# EAGLE design retro_hat_v1 (EAGLE 7.5.0)
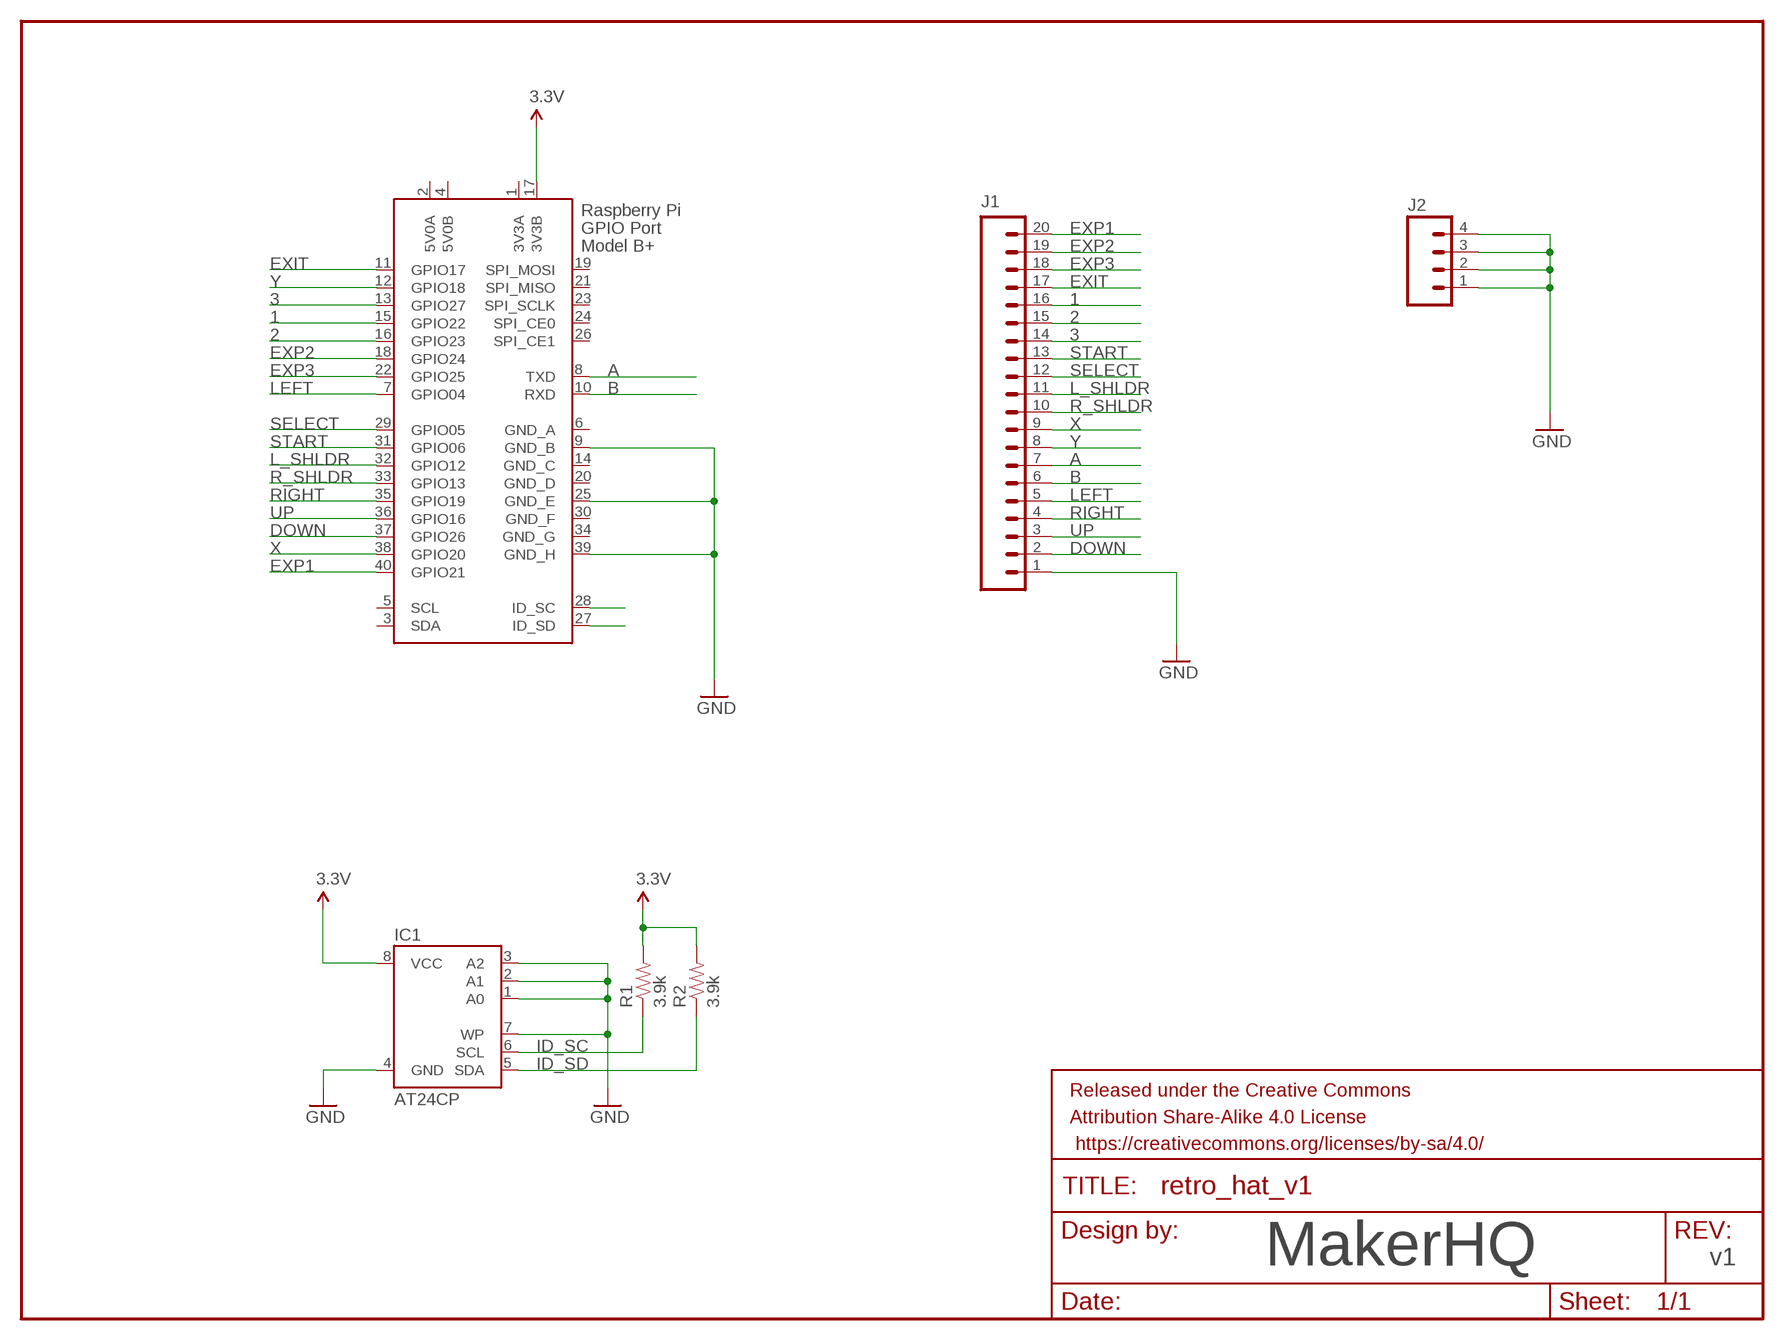
[diagram p0: schematic, sheet 1]

## Parts
FRAME1  FRAME-LETTERNO_PACKAGE  [DUMMY]
IC1  AT24CP  [DIL08]
J1  M20  [1X20]
J2  M04PTH  [1X04]
R1  3.9k  RESISTORPTH-1/4W  [AXIAL-0.4]
R2  3.9k  RESISTORPTH-1/4W  [AXIAL-0.4]
X1  RASPI_BOARD_B+#_HD  [RASPI_BOARD_B+HAT_DF]

## Nets
1: J1.16 X1.15(GPIO22)
2: J1.15 X1.16(GPIO23)
3: J1.14 X1.13(GPIO27)
3.3V: IC1.8(VCC) R1.P$2 R2.P$2 X1.17(3V3B)
A: J1.7 X1.8(TXD)
B: J1.6 X1.10(RXD)
DOWN: J1.2 X1.37(GPIO26)
EXIT: J1.17 X1.11(GPIO17)
EXP1: J1.20 X1.40(GPIO21)
EXP2: J1.19 X1.18(GPIO24)
EXP3: J1.18 X1.22(GPIO25)
GND: IC1.1(A0) IC1.2(A1) IC1.3(A2) IC1.4(GND) IC1.7(WP) J1.1 J2.1 J2.2 J2.3 J2.4 X1.9(GND_B) X1.25(GND_E) X1.39(GND_H)
ID_SC: IC1.6(SCL) R1.P$1 X1.28(ID_SC)
ID_SD: IC1.5(SDA) R2.P$1 X1.27(ID_SD)
L_SHLDR: J1.11 X1.32(GPIO12)
LEFT: J1.5 X1.7(GPIO04)
R_SHLDR: J1.10 X1.33(GPIO13)
RIGHT: J1.4 X1.35(GPIO19)
SELECT: J1.12 X1.29(GPIO05)
START: J1.13 X1.31(GPIO06)
UP: J1.3 X1.36(GPIO16)
X: J1.9 X1.38(GPIO20)
Y: J1.8 X1.12(GPIO18)
Unconnected: X1.3(SDA) X1.5(SCL) X1.19(SPI_MOSI) X1.21(SPI_MISO) X1.23(SPI_SCLK) X1.24(SPI_CE0) X1.26(SPI_CE1)

## Notes on the sheet
- MakerHQ | v1

## Power pins joined to a net without a drawn wire
3V3A: X1.1(3V3A)
5V0A: X1.2(5V0A)
5V0B: X1.4(5V0B)
GND_A: X1.6(GND_A)
GND_C: X1.14(GND_C)
GND_D: X1.20(GND_D)
GND_F: X1.30(GND_F)
GND_G: X1.34(GND_G)

## Library data of the parts
FRAME1 = SparkFun-Aesthetics:FRAME-LETTER: Schematic Frame Standard 8.5x11 US Letter frame; DESIGNER: Nobody; VERSION: v01
IC1 = atmel:AT24C*: 2-wire serial EEPROM; MPN: AT24C1024BW-SH-B; OC_FARNELL: 1362646; OC_NEWARK: 03P2044
J1 = SparkFun-Connectors:M20: 1x20 .1" header This is just like the LOCK variant in that the holes are staggared by 5 mil, but except for the last two holes. They are not altered from the "standard" footprint layout. This is used for a special purpose on the layout of our Graphic LCD Backpack. Make sure you want to use this device before selecting it for you project!
J2 = SparkFun-Connectors:M04: Header 4 Standard 4-pin 0.1" header. Use with straight break away headers (SKU : PRT-00116), right angle break away headers (PRT-00553), swiss pins (PRT-00743), machine pins (PRT-00117), and female headers (PRT-00115). Molex polarized connector foot print use with SKU : PRT-08231 with associated crimp pins and housings. 1MM SMD Version SKU: PRT-10208; PROD_ID: CONN-09696
R1 R2 = SparkFun-Passives:RESISTOR: Resistor Basic schematic elements and footprints for 0603, 1206, and PTH resistors.
X1 = raspberrypi_bastelstube_v13:RASPI_BOARD_B+#: Raspberry Pi GPIO connector with markings for the outer dimensions of the Raspberry Pi board model B+ with different sets of drill holes or mounting pads All pins connected

## Board
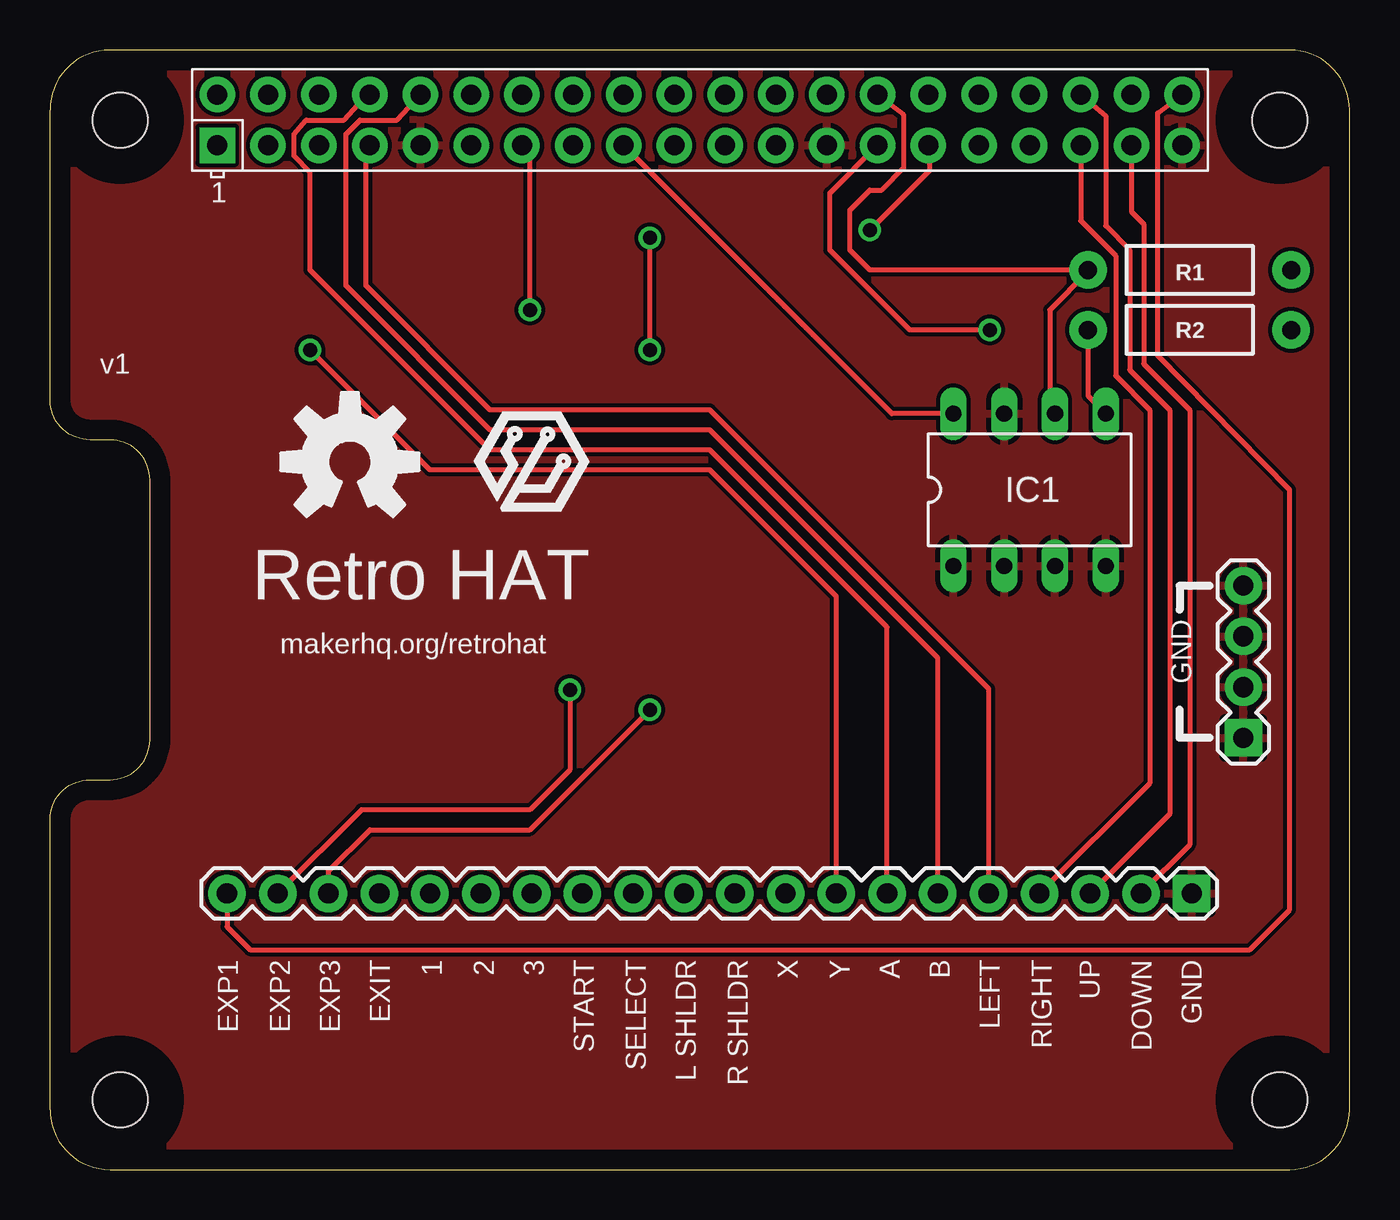
[diagram p1: board, top side]
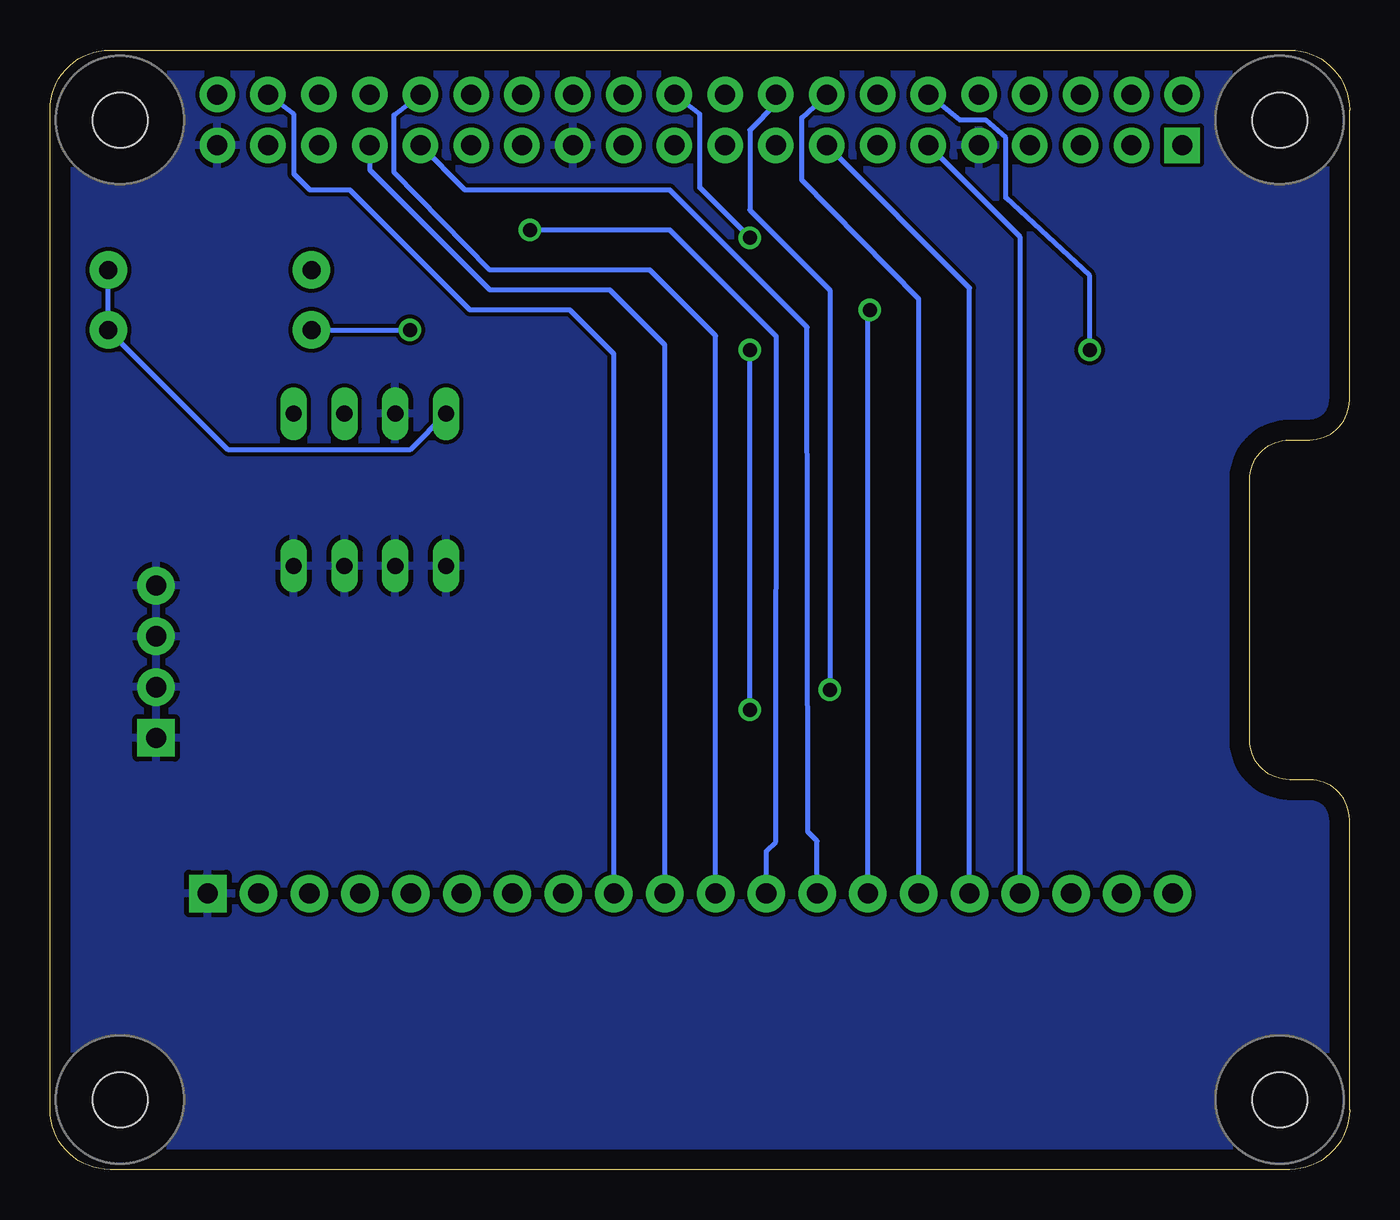
[diagram p2: board, bottom side, seen from below]

Size 65 x 56 mm. Coordinates in mm from the lower left corner, seen from the top.
Copper layers (1*16): Top 0.035mm / dielectric 1.5mm / Bottom 0.035mm
Design rules "default": minimum track width 10mil, minimum drill 24mil, track to track 8mil, track to pad 8mil, pad to pad 8mil, via to via 8mil, smd to smd 8mil, copper to edge 40mil, drill to drill 8mil, minimum pad ring 10mil, minimum via ring 8mil, stop-mask expansion 4mil, vias tented up to drill 0mil, thermal gap 10mil
tRestrict: area 1.2,50.2 to 5.8,54.8; area 1.2,1.2 to 5.8,5.8; area 59.2,1.2 to 63.8,5.8; area 59.2,50.2 to 63.8,54.8
bRestrict: area 1.2,50.2 to 5.8,54.8; area 59.2,50.2 to 63.8,54.8; area 1.2,1.2 to 5.8,5.8; area 59.2,1.2 to 63.8,5.8

### Footprints (pad centres in the part's own frame; a part is rotated, then mirrored left to right if it is on the bottom)
DIL08 = drill 0.813 long: 1 -3.81,-3.81; 2 -1.27,-3.81; 3 1.27,-3.81; 4 3.81,-3.81; 5 3.81,3.81; 6 1.27,3.81; 7 -1.27,3.81; 8 -3.81,3.81
1X20 = drill 1.016 pad 1.88 square: 1 0,0 | drill 1.016 pad 1.88: 2 2.54,0; 3 5.08,0; 4 7.62,0; 5 10.16,0; 6 12.7,0; 7 15.24,0; 8 17.78,0; 9 20.32,0; 10 22.86,0; 11 25.4,0; 12 27.94,0; 13 30.48,0; 14 33.02,0; 15 35.56,0; 16 38.1,0; 17 40.64,0; 18 43.18,0; 19 45.72,0; 20 48.26,0
1X04 = drill 1.016 pad 1.88 square: 1 0,0 | drill 1.016 pad 1.88: 2 2.54,0; 3 5.08,0; 4 7.62,0
AXIAL-0.4 = drill 0.9 pad 1.88: P$1 -5.08,0; P$2 5.08,0
RASPI_BOARD_B+HAT_DF = drill 1 pad 1.778 square: 1 8.37,51.23 | drill 1 pad 1.778: 2 8.37,53.77; 3 10.91,51.23; 4 10.91,53.77; 5 13.45,51.23; 6 13.45,53.77; 7 15.99,51.23; 8 15.99,53.77; 9 18.53,51.23; 10 18.53,53.77; 11 21.07,51.23; 12 21.07,53.77; 13 23.61,51.23; 14 23.61,53.77; 15 26.15,51.23; 16 26.15,53.77; 17 28.69,51.23; 18 28.69,53.77; 19 31.23,51.23; 20 31.23,53.77; 21 33.77,51.23; 22 33.77,53.77; 23 36.31,51.23; 24 36.31,53.77; 25 38.85,51.23; 26 38.85,53.77; 27 41.39,51.23; 28 41.39,53.77; 29 43.93,51.23; 30 43.93,53.77; 31 46.47,51.23; 32 46.47,53.77; 33 49.01,51.23; 34 49.01,53.77; 35 51.55,51.23; 36 51.55,53.77; 37 54.09,51.23; 38 54.09,53.77; 39 56.63,51.23; 40 56.63,53.77 | hole 2.75: 3.5,3.5; 3.5,52.5; 61.5,3.5; 61.5,52.5

### Placement (x,y rotation side)
FRAME1  -52.07,67.31 0 top  (outside the outline)
IC1  49,34 0 top
J1  57.11,13.81 180 top
J2  59.69,21.59 90 top
R1  57,45 0 top
R2  57,42 0 top
U$1  [MAKERHQ_LOGO_L]  21.2,32.9 0 top
U$2  [OSHW-LOGO-L]  15,35.4 0 top
X1  0,0 0 top

### Tracks (layer width: path | path; a pad name or v marks a point on that pad's centre or on a via)
1
  Bottom 0.254: J1.16 19.01,44.09 X1.15
2
  Bottom 0.254: J1.15 21.55,43.55 27.4,49.5 27.4,52.62 X1.16
3  (via drill 0.7)
  Top 0.254: v24,43 24,50.84 X1.13
  Bottom 0.254: J1.14 24.09,42.91 v24,43
3.3V
  Top 0.254: IC1.8 42.11,37.81 X1.17
  Bottom 0.254: IC1.8 47,36 56.08,36 R2.P$2 R1.P$2
A
  Top 0.254: J1.7 41.87,27.13 33,36 22,36 13,45 13,49.9 12.2,50.7 12.2,51.8 12.82,52.5 14.7,52.5 15.87,53.77 X1.8
B
  Top 0.254: J1.6 44.41,25.59 33,37 22,37 14.8,44.2 14.8,51.8 15.5,52.5 17.36,52.5 X1.10
DOWN
  Top 0.254: X1.37 54.09,47.91 54.7,47.3 54.7,40.3 57,38 57,16.24 J1.2
EXIT
  Bottom 0.254: J1.17 16.47,46.63 X1.11
EXP1
  Top 0.254: J1.20 8.85,12.15 10,11 60,11 62,13 62,34 55.4,40.7 55.4,52.84 X1.40
EXP2  (via drill 0.7)
  Top 0.254: v26,24 26,20 24,18 15.58,18 J1.19
  Bottom 0.254: X1.18 28.69,53.31 30,52 30,48 26,44 v26,24
EXP3  (via drill 0.7)
  Top 0.254: J1.18 13.93,14.93 16,17 24,17 v30,23 | v30,41 v30,46.6
  Bottom 0.254: v30,23 v30,41 | v30,46.6 32.5,49.1 32.5,52.8 X1.22
GND
  pour Top: 0,0 65,0 65,56 0,56
  pour Bottom: 0,0 65,0 65,56 0,56
ID_SC
  Top 0.254: IC1.6 50,38.08 50,43 51.92,44.92 R1.P$1 41,45 40,46 40,48 41,49 41.6,49 42.7,50.1 42.7,52.76 X1.28
ID_SD  (via drill 0.7)
  Top 0.254: R2.P$1 51.92,38.7 IC1.5 | v47,42 43,42 39,46 39,48.84 X1.27
  Bottom 0.254: R2.P$1 v47,42
L_SHLDR
  Bottom 0.254: J1.11 31.71,41.71 35,45 43,45 47.8,49.9 47.8,52.74 X1.32
LEFT
  Top 0.254: J1.5 46.95,24.05 33,38 22,38 15.8,44.2 15.8,50.94 X1.7
R_SHLDR
  Bottom 0.254: J1.10 34.25,41.25 37,44 43,44 49,50 X1.33
RIGHT
  Top 0.254: X1.35 51.55,47.45 53.3,45.7 53.3,39.7 55,38 55,19.32 J1.4
SELECT  (via drill 0.7)
  Top 0.254: v41,47 44,50 44,51.16 X1.29
  Bottom 0.254: J1.12 29.17,15.93 28.7,16.4 28.67,41.67 34,47 v41,47
START
  Bottom 0.254: J1.13 26.63,16.43 27.1,16.9 27.13,42.13 34,49 44.24,49 X1.31
UP
  Top 0.254: X1.36 52.03,53.37 52.8,52.7 52.8,47.2 54,46 54,40 56,38 56,17.78 J1.3
X
  Bottom 0.254: J1.9 36.79,40.79 39,43 44,43 50,49 52,49 52.8,49.8 52.8,52.78 X1.38
Y  (via drill 0.7)
  Top 0.254: J1.8 39.33,28.67 33,35 19,35 v13,41
  Bottom 0.254: v13,41 13,44.7 17.2,48.6 17.2,51.6 18.2,52.5 19.5,52.5 X1.12

### Text on the board
tPlace: v1 | Retro HAT | makerhq.org/retrohat | GND | EXP1 | EXP2 | EXP3 | EXIT | 1 | 2 | 3 | START | SELECT | L SHLDR | R SHLDR | X | Y | A | B | LEFT | RIGHT | UP | DOWN | GND